# EAGLE schematic Esquema v16 (EAGLE 9.7.0)
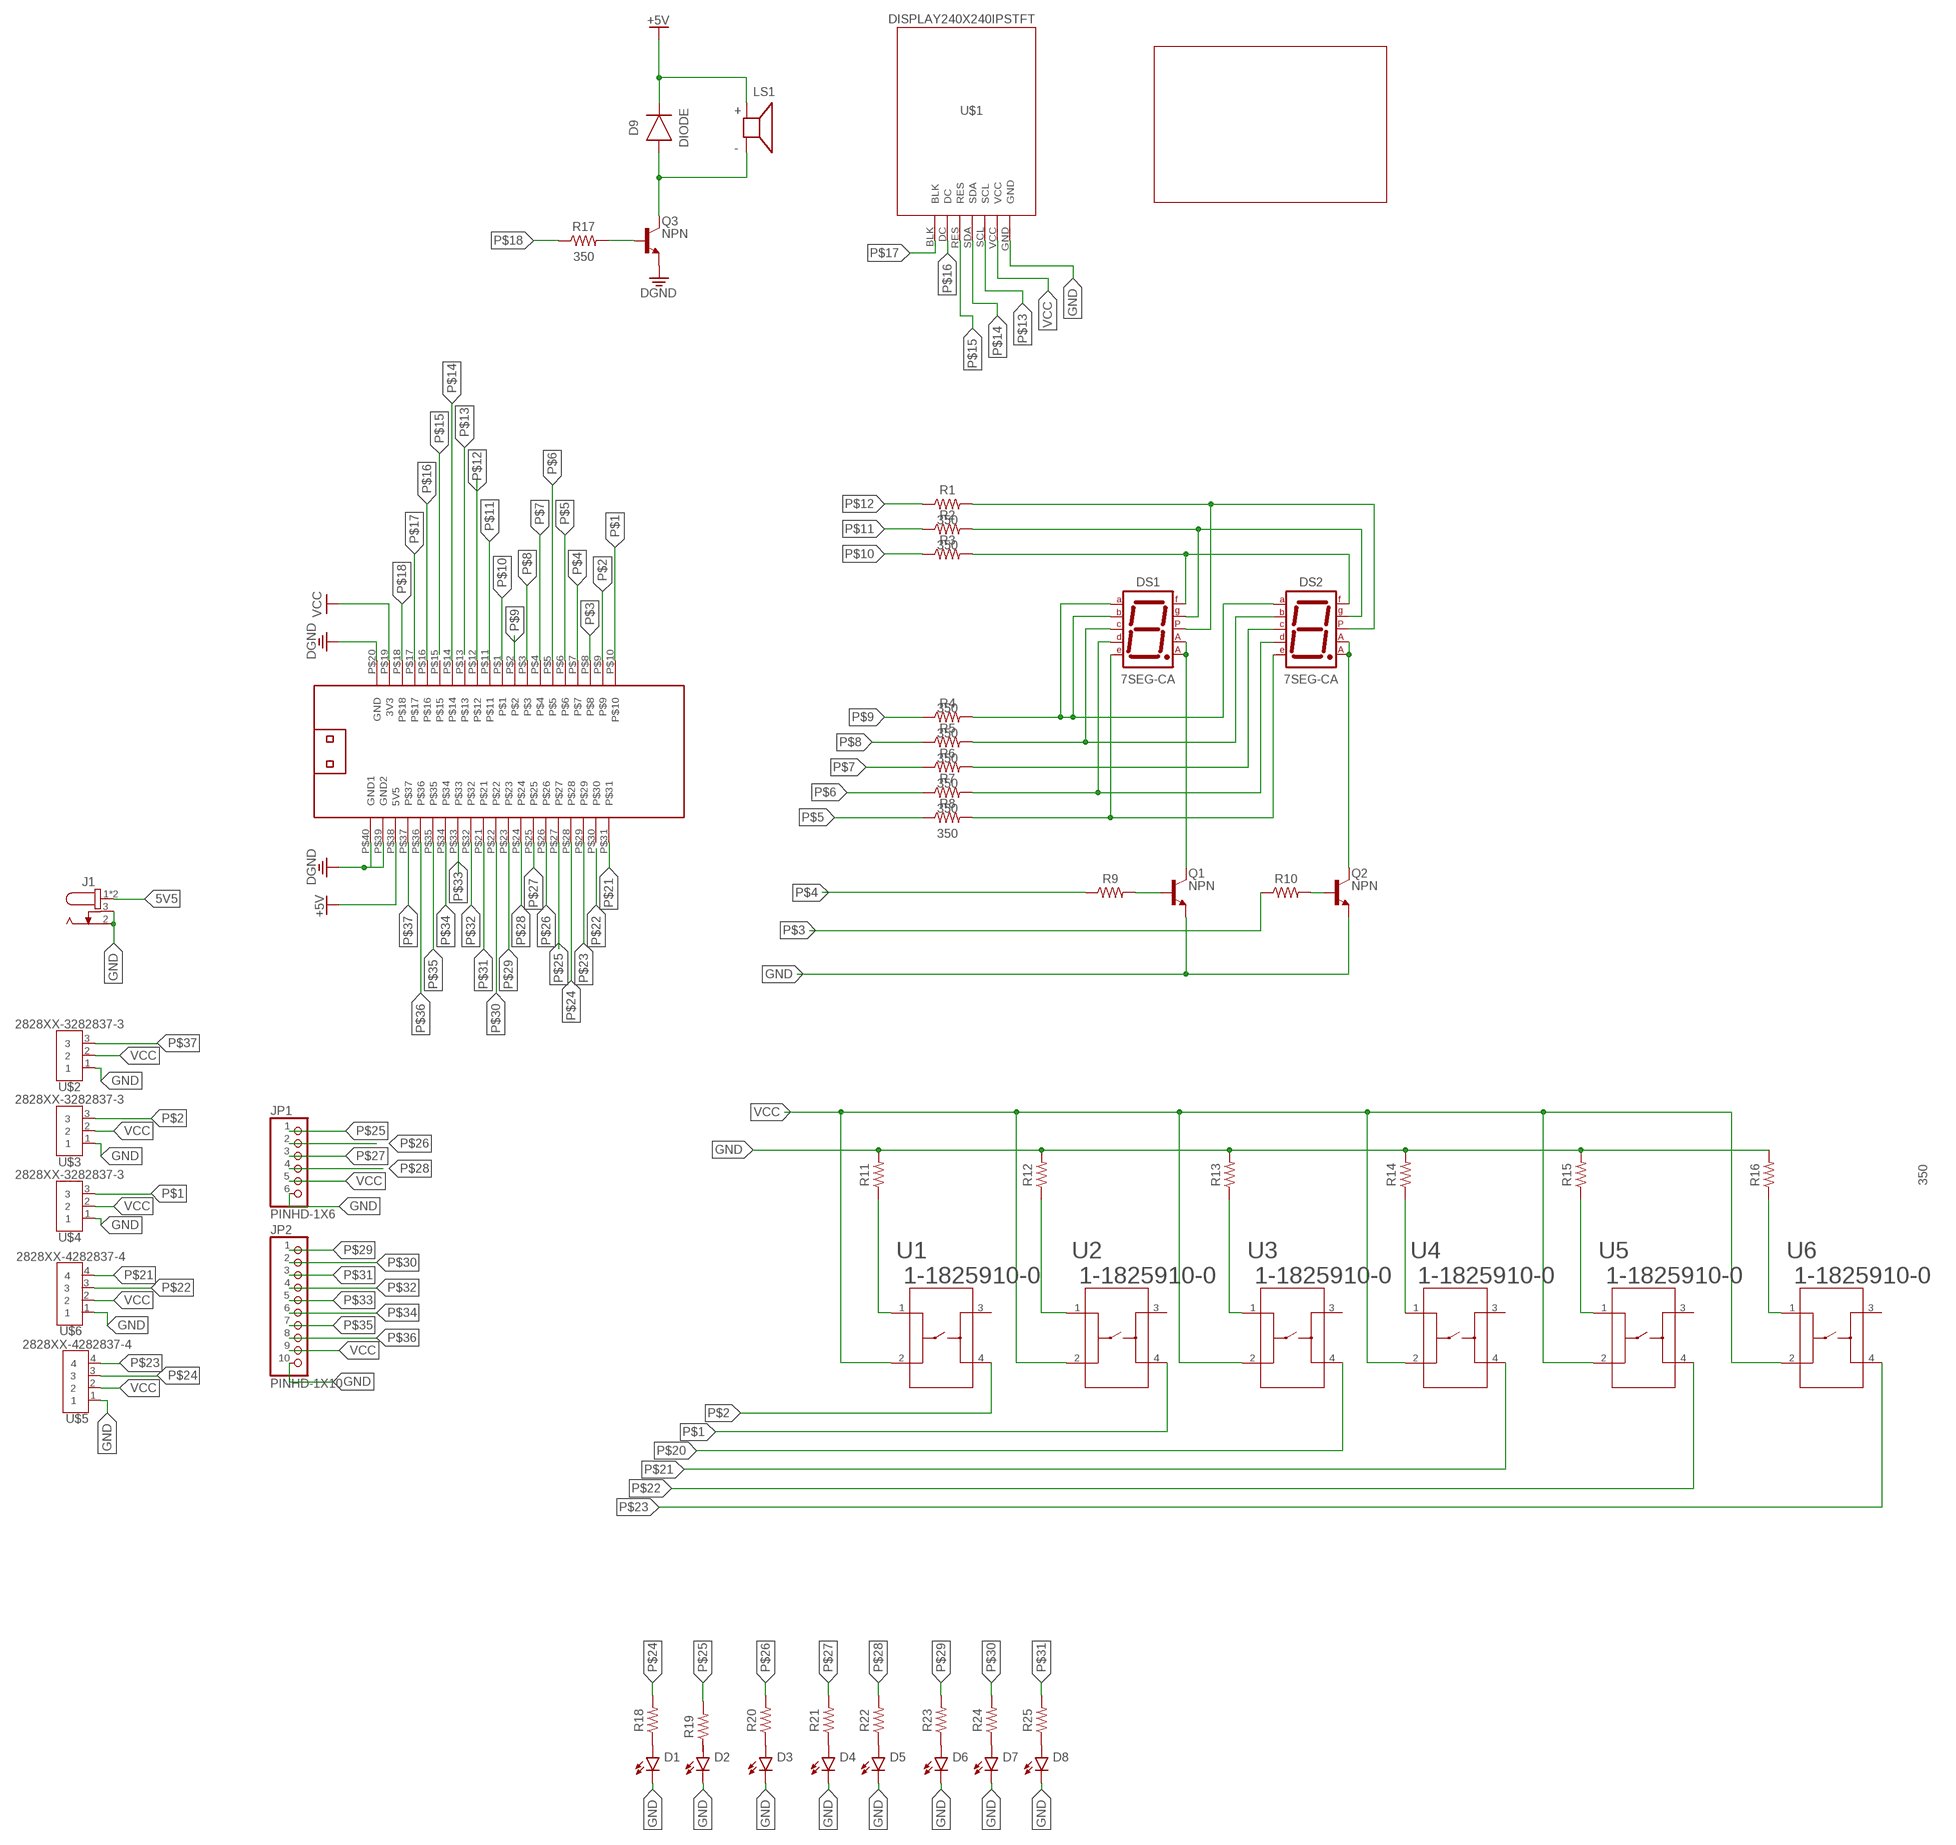
[diagram p0: schematic, sheet 1]

## Parts
D1  LED_RADIALGREEN  [LEDRD254W60D565H860B_G]
D2  LED_RADIALGREEN  [LEDRD254W60D565H860B_G]
D3  LED_RADIALGREEN  [LEDRD254W60D565H860B_G]
D4  LED_RADIALGREEN  [LEDRD254W60D565H860B_G]
D5  LED_RADIALGREEN  [LEDRD254W60D565H860B_G]
D6  LED_RADIALGREEN  [LEDRD254W60D565H860B_G]
D7  LED_RADIALGREEN  [LEDRD254W60D565H860B_G]
D8  LED_RADIALGREEN  [LEDRD254W60D565H860B_G]
D9  DIODE  DIODEDO-214AB(SMC)  [DIOM7959X625N]
DS1  7SEG-CA  [7SEG-13]
DS2  7SEG-CA  [7SEG-13]
FRANZ1  FRANZININHO  [FRANZININHO]
J1  694108106102  [694108106102]
JP1  PINHD-1X6  [1X06]
JP2  PINHD-1X10  [1X10]
LS1  AI-1223-TWT-5V-R  [XDCR_AI-1223-TWT-5V-R]
Q1  NPN  NPN_TO18-EBC  [TO18]
Q2  NPN  NPN_TO18-EBC  [TO18]
Q3  NPN  NPN_TO18-EBC  [TO18]
R1  350  R-US_AXIAL-7.2MM-PITCH  [RESAD724W46L381D178B]
R2  350  R-US_AXIAL-7.2MM-PITCH  [RESAD724W46L381D178B]
R3  350  R-US_AXIAL-7.2MM-PITCH  [RESAD724W46L381D178B]
R4  350  R-US_AXIAL-7.2MM-PITCH  [RESAD724W46L381D178B]
R5  350  R-US_AXIAL-7.2MM-PITCH  [RESAD724W46L381D178B]
R6  350  R-US_AXIAL-7.2MM-PITCH  [RESAD724W46L381D178B]
R7  350  R-US_AXIAL-7.2MM-PITCH  [RESAD724W46L381D178B]
R8  350  R-US_AXIAL-7.2MM-PITCH  [RESAD724W46L381D178B]
R9  350  R-US_AXIAL-7.2MM-PITCH  [RESAD724W46L381D178B]
R10  350  R-US_AXIAL-7.2MM-PITCH  [RESAD724W46L381D178B]
R11  350  R-US_AXIAL-7.2MM-PITCH  [RESAD724W46L381D178B]
R12  350  R-US_AXIAL-7.2MM-PITCH  [RESAD724W46L381D178B]
R13  350  R-US_AXIAL-7.2MM-PITCH  [RESAD724W46L381D178B]
R14  350  R-US_AXIAL-7.2MM-PITCH  [RESAD724W46L381D178B]
R15  350  R-US_AXIAL-7.2MM-PITCH  [RESAD724W46L381D178B]
R16  350  R-US_AXIAL-7.2MM-PITCH  [RESAD724W46L381D178B]
R17  350  R-US_AXIAL-7.2MM-PITCH  [RESAD724W46L381D178B]
R18  350  R-US_AXIAL-7.2MM-PITCH  [RESAD724W46L381D178B]
R19  350  R-US_AXIAL-7.2MM-PITCH  [RESAD724W46L381D178B]
R20  350  R-US_AXIAL-7.2MM-PITCH  [RESAD724W46L381D178B]
R21  350  R-US_AXIAL-7.2MM-PITCH  [RESAD724W46L381D178B]
R22  350  R-US_AXIAL-7.2MM-PITCH  [RESAD724W46L381D178B]
R23  350  R-US_AXIAL-7.2MM-PITCH  [RESAD724W46L381D178B]
R24  350  R-US_AXIAL-7.2MM-PITCH  [RESAD724W46L381D178B]
R25  350  R-US_AXIAL-7.2MM-PITCH  [RESAD724W46L381D178B]
U1  1-1825910-0  [SWITCH_1-1825910-0]
U2  1-1825910-0  [SWITCH_1-1825910-0]
U3  1-1825910-0  [SWITCH_1-1825910-0]
U4  1-1825910-0  [SWITCH_1-1825910-0]
U5  1-1825910-0  [SWITCH_1-1825910-0]
U6  1-1825910-0  [SWITCH_1-1825910-0]
U$1  DISPLAY240X240IPSTFT  [TFT]
U$2  2828XX-3282837-3  [TERMBLK_508-3N]
U$3  2828XX-3282837-3  [TERMBLK_508-3N]
U$4  2828XX-3282837-3  [TERMBLK_508-3N]
U$5  2828XX-4282837-4  [TERMBLK_508-4N]
U$6  2828XX-4282837-4  [TERMBLK_508-4N]
U$7  PROTOBOARD  [PROTOBOARD]

## Nets
5V5: J1.1 J1.A1
+5V: D9.1(C) FRANZ1.P$38(5V5) LS1.P(+)
DGND: FRANZ1.P$20(GND) FRANZ1.P$39(GND2) FRANZ1.P$40(GND1) Q3.1(E)
GND: D1.2(C) D2.2(C) D3.2(C) D4.2(C) D5.2(C) D6.2(C) D7.2(C) D8.2(C) J1.2 J1.3 JP1.6 JP2.10 Q1.1(E) Q2.1(E) R11.2 R12.2 R13.2 R14.2 R15.2 R16.2 U$1.GND U$2.1 U$3.1 U$4.1 U$5.1 U$6.1
N$1: Q3.2(B) R17.2
N$2: D1.1(A) R18.1
N$3: D3.1(A) R20.1
N$4: D4.1(A) R21.1
N$5: D5.1(A) R22.1
N$6: D6.1(A) R23.1
N$7: D7.1(A) R24.1
N$8: DS1.9(F) DS2.9(F) R3.2
N$9: D8.1(A) R25.1
N$11: DS1.10(G) DS2.10(G) R2.2
N$12: DS1.5(DP) DS2.5(DP) R1.2
N$13: DS1.1(E) DS2.1(E) R8.2
N$14: DS1.2(D) DS2.2(D) R7.2
N$15: DS2.4(C) R6.2
N$16: DS1.4(C) DS2.6(B) R5.2
N$17: DS1.6(B) DS1.7(A) DS2.7(A) R4.2
N$18: DS1.3(CA1) DS1.8(CA2) Q1.3(C)
N$19: DS2.3(CA1) DS2.8(CA2) Q2.3(C)
N$20: Q1.2(B) R9.2
N$21: Q2.2(B) R10.2
N$30: R16.1 U6.1
N$31: R15.1 U5.1
N$32: R14.1 U4.1
N$33: R13.1 U3.1
N$34: R12.1 U2.1
N$35: R11.1 U1.1
N$45: D9.2(A) LS1.N(-) Q3.3(C)
P$1: FRANZ1.P$10 U2.4 U$4.3
P$2: FRANZ1.P$9 U1.4 U$3.3
P$3: FRANZ1.P$8 R10.1
P$4: FRANZ1.P$7 R9.1
P$5: FRANZ1.P$6 R8.1
P$6: FRANZ1.P$5 R7.1
P$7: FRANZ1.P$4 R6.1
P$8: FRANZ1.P$3 R5.1
P$9: FRANZ1.P$2 R4.1
P$10: FRANZ1.P$1 R3.1
P$11: FRANZ1.P$11 R2.1
P$12: FRANZ1.P$12 R1.1
P$13: U$1.SCL
P$14: FRANZ1.P$14 U$1.SDA
P$15: U$1.RES
P$16: FRANZ1.P$16 U$1.DC
P$17: FRANZ1.P$17 U$1.BLK
P$18: FRANZ1.P$18 R17.1
P$20: U3.4
P$21: FRANZ1.P$31 U4.4 U$6.4
P$22: U5.4 U$6.3
P$23: FRANZ1.P$29 U6.4 U$5.4
P$24: FRANZ1.P$28 R18.2 U$5.3
P$25: FRANZ1.P$27 JP1.1 R19.2
P$26: FRANZ1.P$26 JP1.2 R20.2
P$27: FRANZ1.P$25 JP1.3 R21.2
P$28: FRANZ1.P$24 JP1.4 R22.2
P$29: FRANZ1.P$23 JP2.1 R23.2
P$30: FRANZ1.P$22 JP2.2 R24.2
P$31: FRANZ1.P$21 JP2.3 R25.2
P$32: FRANZ1.P$32 JP2.4
P$33: FRANZ1.P$33 JP2.5
P$34: FRANZ1.P$34 JP2.6
P$35: FRANZ1.P$35 JP2.7
P$36: FRANZ1.P$36 JP2.8
P$37: FRANZ1.P$37 U$2.3
VCC: FRANZ1.P$19(3V3) JP1.5 JP2.9 U1.2 U2.2 U3.2 U4.2 U5.2 U6.2 U$1.VCC U$2.2 U$3.2 U$4.2 U$5.2 U$6.2
Unconnected: D2.1(A) FRANZ1.P$13 FRANZ1.P$15 FRANZ1.P$30 R19.1 U1.3 U2.3 U3.3 U4.3 U5.3 U6.3

## Library data of the parts
D1-D8 = led verde:LED_RADIAL: LED - Generic
D9 = Diode:DIODE: Diode Rectifier - Generic; CATEGORY: Diode; SUB-CATEGORY: Rectifier
DS1 DS2 = _led verde.e28fa6e2-375f-4f9b-b292-f28eee2f90ad.flbr:7SEG-CA: 7-segment DISPLAY single anode, 13 mm; CATEGORY: Opto-Electronic; SUB-CATEGORY: Display; TYPE: 7-Segment
FRANZ1 = USB:FRANZININHO
J1 = Connector:694108106102: WR-DC DC Power Jack Right Angled SMT Ø 6.4 with 4 soldering pads & pegs Datasheet <https://katalog.we-online.com/en/em/DC_SMT_RIGHT_ANGLED_6_4_WITH_4_SOLDER_PADS_PEGS_69410X106102>; CATEGORY: Connector; DESCRIPTION: CONN PWR JACK 2.5X5.5MM SOLDER; MANUFACTURER: Würth Elektronik; MOUNT: SMT; MPN: 694108106102; OPERATING_TEMPERATURE: -40°C to +85°C; PART_STATUS: Active; ROHS_COMPLIANCE: RoHS Compliant; SERIES: WR-DC; SUBCATEGORY: Power Connector; TYPE: Barrel-Right Angled
JP1 = Connector:PINHD-1X6: PIN HEADER; CATEGORY: CONNECTOR; SUB-CATEGORY: PIN-HEADER
JP2 = Connector:PINHD-1X10: PIN HEADER; CATEGORY: CONNECTOR; SUB-CATEGORY: PIN-HEADER
LS1 = Buzzer:AI-1223-TWT-5V-R: Check availability <https://pricing.snapeda.com/parts/AI-1223-TWT-5V-R/PUI%20Audio%2C/view-part?ref=eda>; AVAILABILITY: In Stock; DESCRIPTION: ELECTRO MECHANICAL AUDIO INDICATOR; MF: PUI Audio,; MP: AI-1223-TWT-5V-R; PACKAGE: 2225 PUI Audio; PRICE: None; PURCHASE-URL: https://pricing.snapeda.com/search/part/AI-1223-TWT-5V-R/?ref=eda
Q1-Q3 = Transistor:NPN: NPN - Generic; CATEGORY: Transistor; SUB-CATEGORY: BJT; TYPE: NPN
R1-R25 = Resistor:R-US: Resistor Fixed - ANSI; CATEGORY: Resistor; SUB-CATEGORY: Fixed
U1-U6 = Switches:1-1825910-0; BUILT_BY: EMA_UL_Team; CATEGORY: Tactile Switches; COPYRIGHT: Copyright (C) 2016 Accelerated Designs. All rights reserved; DESCRIPTION: FSM6JH=6MM TACT SWITCH, HIGH TEMP; MANUFACTURER_PART_NUMBER: 1-1825910-0; PART_STATUS: active; SERIES: Unknown; VENDOR: TE Connectivity
U$1 = Display tft:DISPLAY240X240IPSTFT
U$2-U$4 = Connector:2828XX-3: 3 Position Wire to Board Terminal Block Horizontal with Board Datasheet <https://www.te.com.cn/commerce/DocumentDelivery/DDEController?Action=showdoc&DocId=Catalog+Section%7F1308389_EUROSTYLE_TERMINAL_BLOCKS%7F0607%7Fpdf%7FEnglish%7FENG_CS_1308389_EUROSTYLE_TERMINAL_BLOCKS_0607.pdf%7F2-282837-5>; CATEGORY: Connector; DESCRIPTION: TERM BLK 3P SIDE ENT 5.08mm PCB; MANUFACTURER: TE Connectivity; MPN: 282837-3; OPERATING_TEMPERATURE: -40°C to +105°C; PART_STATUS: Active; ROHS_COMPLIANCE: RoHS Compliant; SERIES: 282837; SUBCATEGORY: Terminal Block; TYPE: Side Wire Entry
U$5 U$6 = Connector:2828XX-4: 4 Position Wire to Board Terminal Block Horizontal with Board Datasheet <https://www.te.com.cn/commerce/DocumentDelivery/DDEController?Action=showdoc&DocId=Catalog+Section%7F1308389_EUROSTYLE_TERMINAL_BLOCKS%7F0607%7Fpdf%7FEnglish%7FENG_CS_1308389_EUROSTYLE_TERMINAL_BLOCKS_0607.pdf%7F2-282837-5>; CATEGORY: Connector; DESCRIPTION: TERM BLK 4P SIDE ENT 5.08mm PCB; MANUFACTURER: TE Connectivity; MPN: 282837-4; OPERATING_TEMPERATURE: 40°C to +105°C; PART_STATUS: Active; ROHS_COMPLIANCE: RoHS Compliant; SERIES: 283737; SUBCATEGORY: Terminal Block; TYPE: Side Wire Entry
U$7 = USB:PROTOBOARD